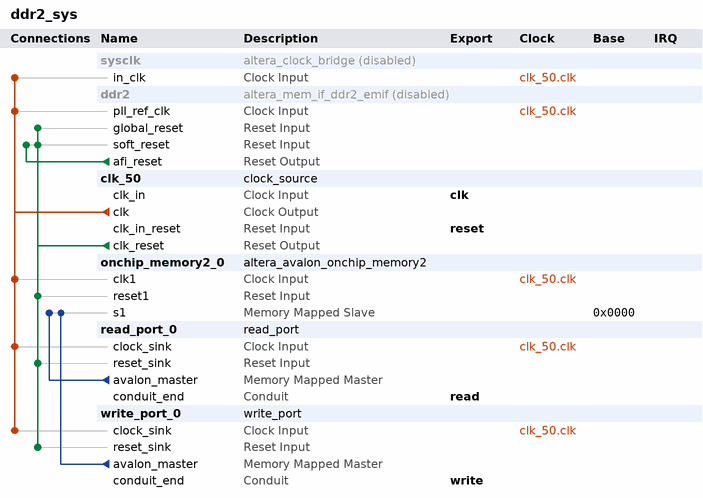
[diagram p0: system contents]
# Platform Designer (Qsys) system ddr2_sys, Stratix III EP3SL150F1152C2
# Parameters at their usual value, and those the tool derives, are not listed.
package require -exact qsys 13.0
create_system ddr2_sys
set_project_property DEVICE_FAMILY {Stratix III}
set_project_property DEVICE EP3SL150F1152C2

add_instance sysclk altera_clock_bridge 13.0
set_instance_property sysclk ENABLED false
set_instance_parameter_value sysclk DERIVED_CLOCK_RATE 50000000
set_instance_parameter_value sysclk EXPLICIT_CLOCK_RATE 0

add_instance ddr2 altera_mem_if_ddr2_emif 13.0
set_instance_property ddr2 ENABLED false
set_instance_parameter_value ddr2 MEM_CLK_FREQ 333.33
set_instance_parameter_value ddr2 MEM_VENDOR Other
set_instance_parameter_value ddr2 MEM_CLK_FREQ_MAX 333.333
set_instance_parameter_value ddr2 MEM_ROW_ADDR_WIDTH 14
set_instance_parameter_value ddr2 MEM_COL_ADDR_WIDTH 10
set_instance_parameter_value ddr2 MEM_DQ_WIDTH 64
set_instance_parameter_value ddr2 MEM_BANKADDR_WIDTH 2
set_instance_parameter_value ddr2 MEM_NUMBER_OF_RANKS_PER_DIMM 2
set_instance_parameter_value ddr2 MEM_RTT_NOM Disabled
set_instance_parameter_value ddr2 MEM_TCL 7
set_instance_parameter_value ddr2 TIMING_TIS 200
set_instance_parameter_value ddr2 TIMING_TIH 275
set_instance_parameter_value ddr2 TIMING_TDS 100
set_instance_parameter_value ddr2 TIMING_TDH 175
set_instance_parameter_value ddr2 TIMING_TDQSQ 240
set_instance_parameter_value ddr2 TIMING_TQHS 400
set_instance_parameter_value ddr2 TIMING_TDQSCK 450
set_instance_parameter_value ddr2 MEM_TMRD_CK 3
set_instance_parameter_value ddr2 MEM_TRAS_NS 45.0
set_instance_parameter_value ddr2 MEM_TRFC_NS 105.0
set_instance_parameter_value ddr2 MEM_TWTR 2
set_instance_parameter_value ddr2 MEM_TFAW_NS 15.3
set_instance_parameter_value ddr2 POWER_OF_TWO_BUS false
set_instance_parameter_value ddr2 AVL_MAX_SIZE 4
set_instance_parameter_value ddr2 REF_CLK_FREQ 50.0
set_instance_parameter_value ddr2 DEFAULT_FAST_SIM_MODEL true
set_instance_parameter_value ddr2 PLL_SHARING_MODE None
set_instance_parameter_value ddr2 EXPORT_AFI_HALF_CLK false
set_instance_parameter_value ddr2 CALIBRATION_MODE Skip
set_instance_parameter_value ddr2 USER_DEBUG_LEVEL 1
set_instance_parameter_value ddr2 TIMING_BOARD_AC_TO_CK_SKEW 0.0
set_instance_parameter_value ddr2 DLL_SHARING_MODE None

add_instance clk_50 clock_source 13.0
set_instance_parameter_value clk_50 clockFrequency 50000000

add_instance onchip_memory2_0 altera_avalon_onchip_memory2 13.0.1.99.2
set_instance_parameter_value onchip_memory2_0 dataWidth 32
set_instance_parameter_value onchip_memory2_0 dualPort false
set_instance_parameter_value onchip_memory2_0 initMemContent false
set_instance_parameter_value onchip_memory2_0 initializationFileName onchip_mem.hex
set_instance_parameter_value onchip_memory2_0 memorySize 153600

add_instance read_port_0 read_port 1.0
set_instance_parameter_value read_port_0 DATAWIDTH 32
set_instance_parameter_value read_port_0 BYTEENABLEWIDTH 4
set_instance_parameter_value read_port_0 ADDRESSWIDTH 30

add_instance write_port_0 write_port 1.0
set_instance_parameter_value write_port_0 DATAWIDTH 32
set_instance_parameter_value write_port_0 BYTEENABLEWIDTH 4
set_instance_parameter_value write_port_0 ADDRESSWIDTH 30

# connections
add_connection clk_50.clk ddr2.pll_ref_clk clock
add_connection clk_50.clk onchip_memory2_0.clk1 clock
add_connection clk_50.clk read_port_0.clock_sink clock
add_connection clk_50.clk sysclk.in_clk clock
add_connection clk_50.clk write_port_0.clock_sink clock
add_connection clk_50.clk_reset ddr2.global_reset reset
add_connection clk_50.clk_reset ddr2.soft_reset reset
add_connection clk_50.clk_reset onchip_memory2_0.reset1 reset
add_connection clk_50.clk_reset read_port_0.reset_sink reset
add_connection clk_50.clk_reset write_port_0.reset_sink reset
add_connection ddr2.afi_reset ddr2.soft_reset reset
add_connection read_port_0.avalon_master onchip_memory2_0.s1 avalon
set_connection_parameter_value read_port_0.avalon_master/onchip_memory2_0.s1 baseAddress 0x0000
add_connection write_port_0.avalon_master onchip_memory2_0.s1 avalon
set_connection_parameter_value write_port_0.avalon_master/onchip_memory2_0.s1 baseAddress 0x0000

# exported interfaces
add_interface clk clock sink
set_interface_property clk EXPORT_OF clk_50.clk_in
add_interface reset reset sink
set_interface_property reset EXPORT_OF clk_50.clk_in_reset
add_interface write conduit end
set_interface_property write EXPORT_OF write_port_0.conduit_end
add_interface read conduit end
set_interface_property read EXPORT_OF read_port_0.conduit_end

set_interconnect_requirement {$system} qsys_mm.clockCrossingAdapter HANDSHAKE
set_interconnect_requirement {$system} qsys_mm.maxAdditionalLatency 1

save_system ddr2_sys.qsys
